# Altium schematic sheet main-schem-v1.SchDoc
size A4
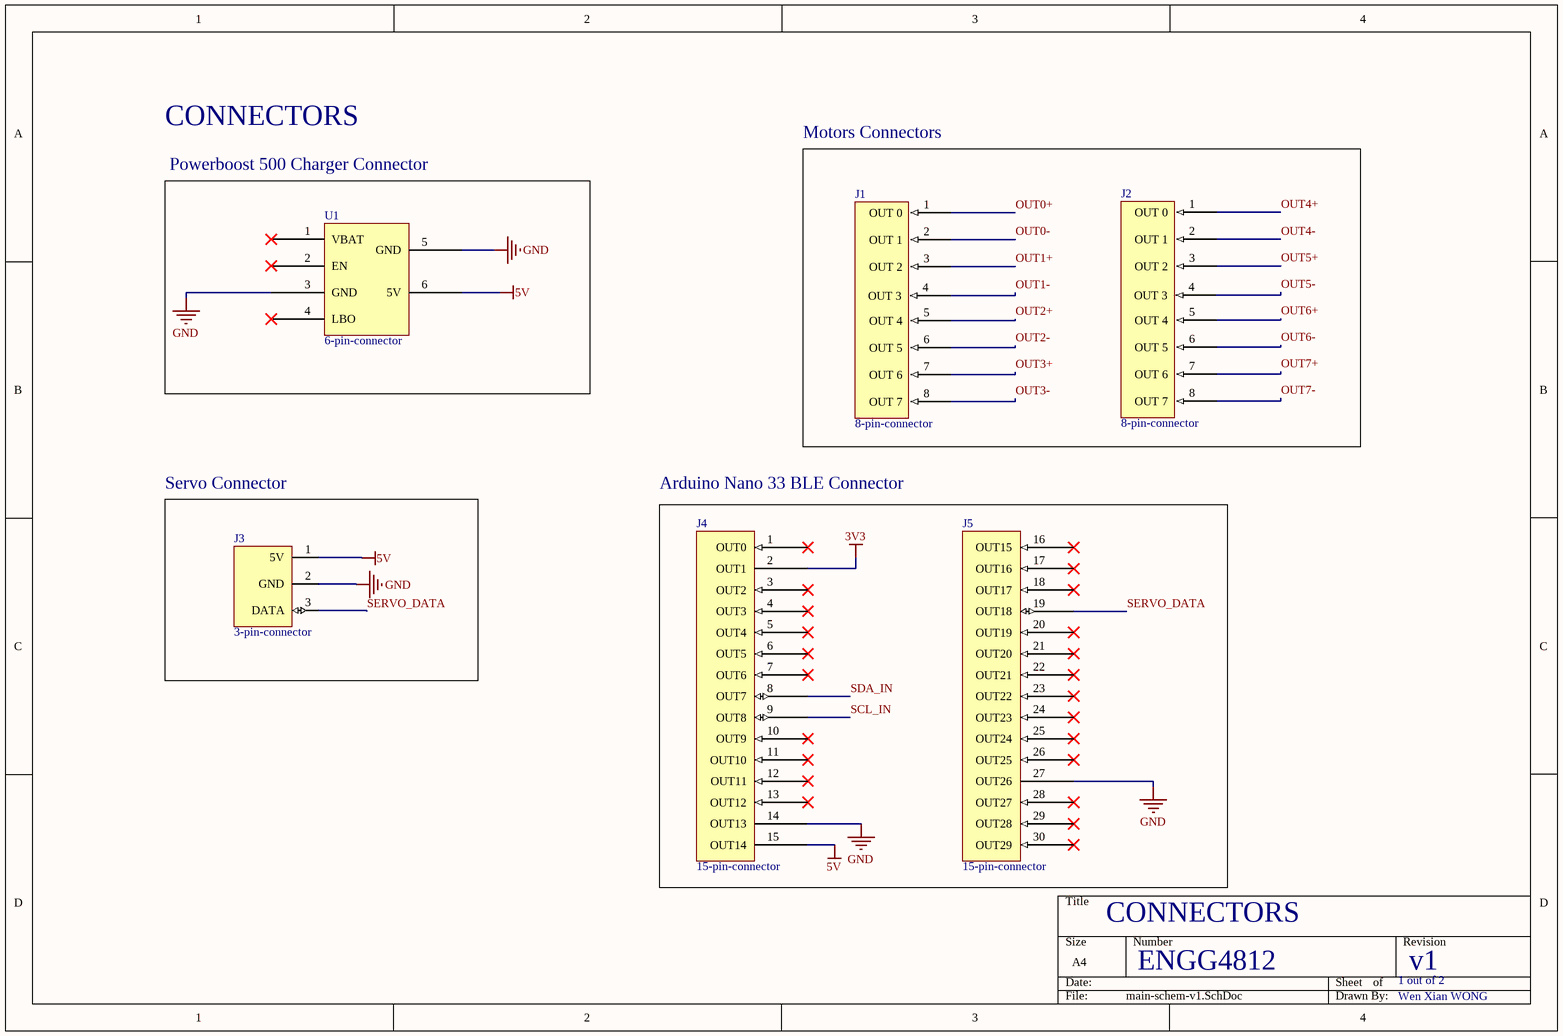
[diagram p0: main-schem-v1.SchDoc]

## Parts
J1  8-pin-connector  [8-PIN-CONNECTOR]
J2  8-pin-connector  [8-PIN-CONNECTOR]
J3  3-pin-connector  [3-pin-connector - duplicate]
J4  15-pin-connector  [15-PIN-CONNECTOR  a - duplicate]
J5  15-pin-connector  [15-PIN-CONNECTOR b - duplicate]
U1  6-pin-connector  [PowerBoost 500]

## Blocks framed on the sheet
Powerboost 500 Charger Connector: U1
Motors Connectors: J1 J2
Servo Connector: J3
Arduino Nano 33 BLE Connector: J4 J5

## Nets
3V3: J4.2(OUT1)
5V: J3.1(5V) J4.15(OUT14) U1.6(5V)
GND: J3.2(GND) J4.14(OUT13) J5.27(OUT26) U1.3(GND) U1.5(GND)
OUT0+: J1.1(OUT_0)
OUT0-: J1.2(OUT_1)
OUT1+: J1.3(OUT_2)
OUT1-: J1.4(OUT_3)
OUT2+: J1.5(OUT_4)
OUT2-: J1.6(OUT_5)
OUT3+: J1.7(OUT_6)
OUT3-: J1.8(OUT_7)
OUT4+: J2.1(OUT_0)
OUT4-: J2.2(OUT_1)
OUT5+: J2.3(OUT_2)
OUT5-: J2.4(OUT_3)
OUT6+: J2.5(OUT_4)
OUT6-: J2.6(OUT_5)
OUT7+: J2.7(OUT_6)
OUT7-: J2.8(OUT_7)
SCL_IN: J4.9(OUT8)
SDA_IN: J4.8(OUT7)
SERVO_DATA: J3.3(DATA) J5.19(OUT18)

Not connected (* = marked no-connect by the designer): J4 1(OUT0)* 3(OUT2)* 4(OUT3)* 5(OUT4)* 6(OUT5)* 7(OUT6)* 10(OUT9)* 11(OUT10)* 12(OUT11)* 13(OUT12)*; J5 16(OUT15)* 17(OUT16)* 18(OUT17)* 20(OUT19)* 21(OUT20)* 22(OUT21)* 23(OUT22)* 24(OUT23)* 25(OUT24)* 26(OUT25)* 28(OUT27)* 29(OUT28)* 30(OUT29)*; U1 1(VBAT)* 2(EN)* 4(LBO)*

## Notes on the sheet
- CONNECTORS
- ENGG4812
- 1 out of 2
- v1
- Wen Xian WONG

## Library data of the parts
J5 = 15-pin-connector b
U1 = Powerboost 500